# EAGLE design uStar (EAGLE 8.5.0)

## Sheet 1 of 3: Connections
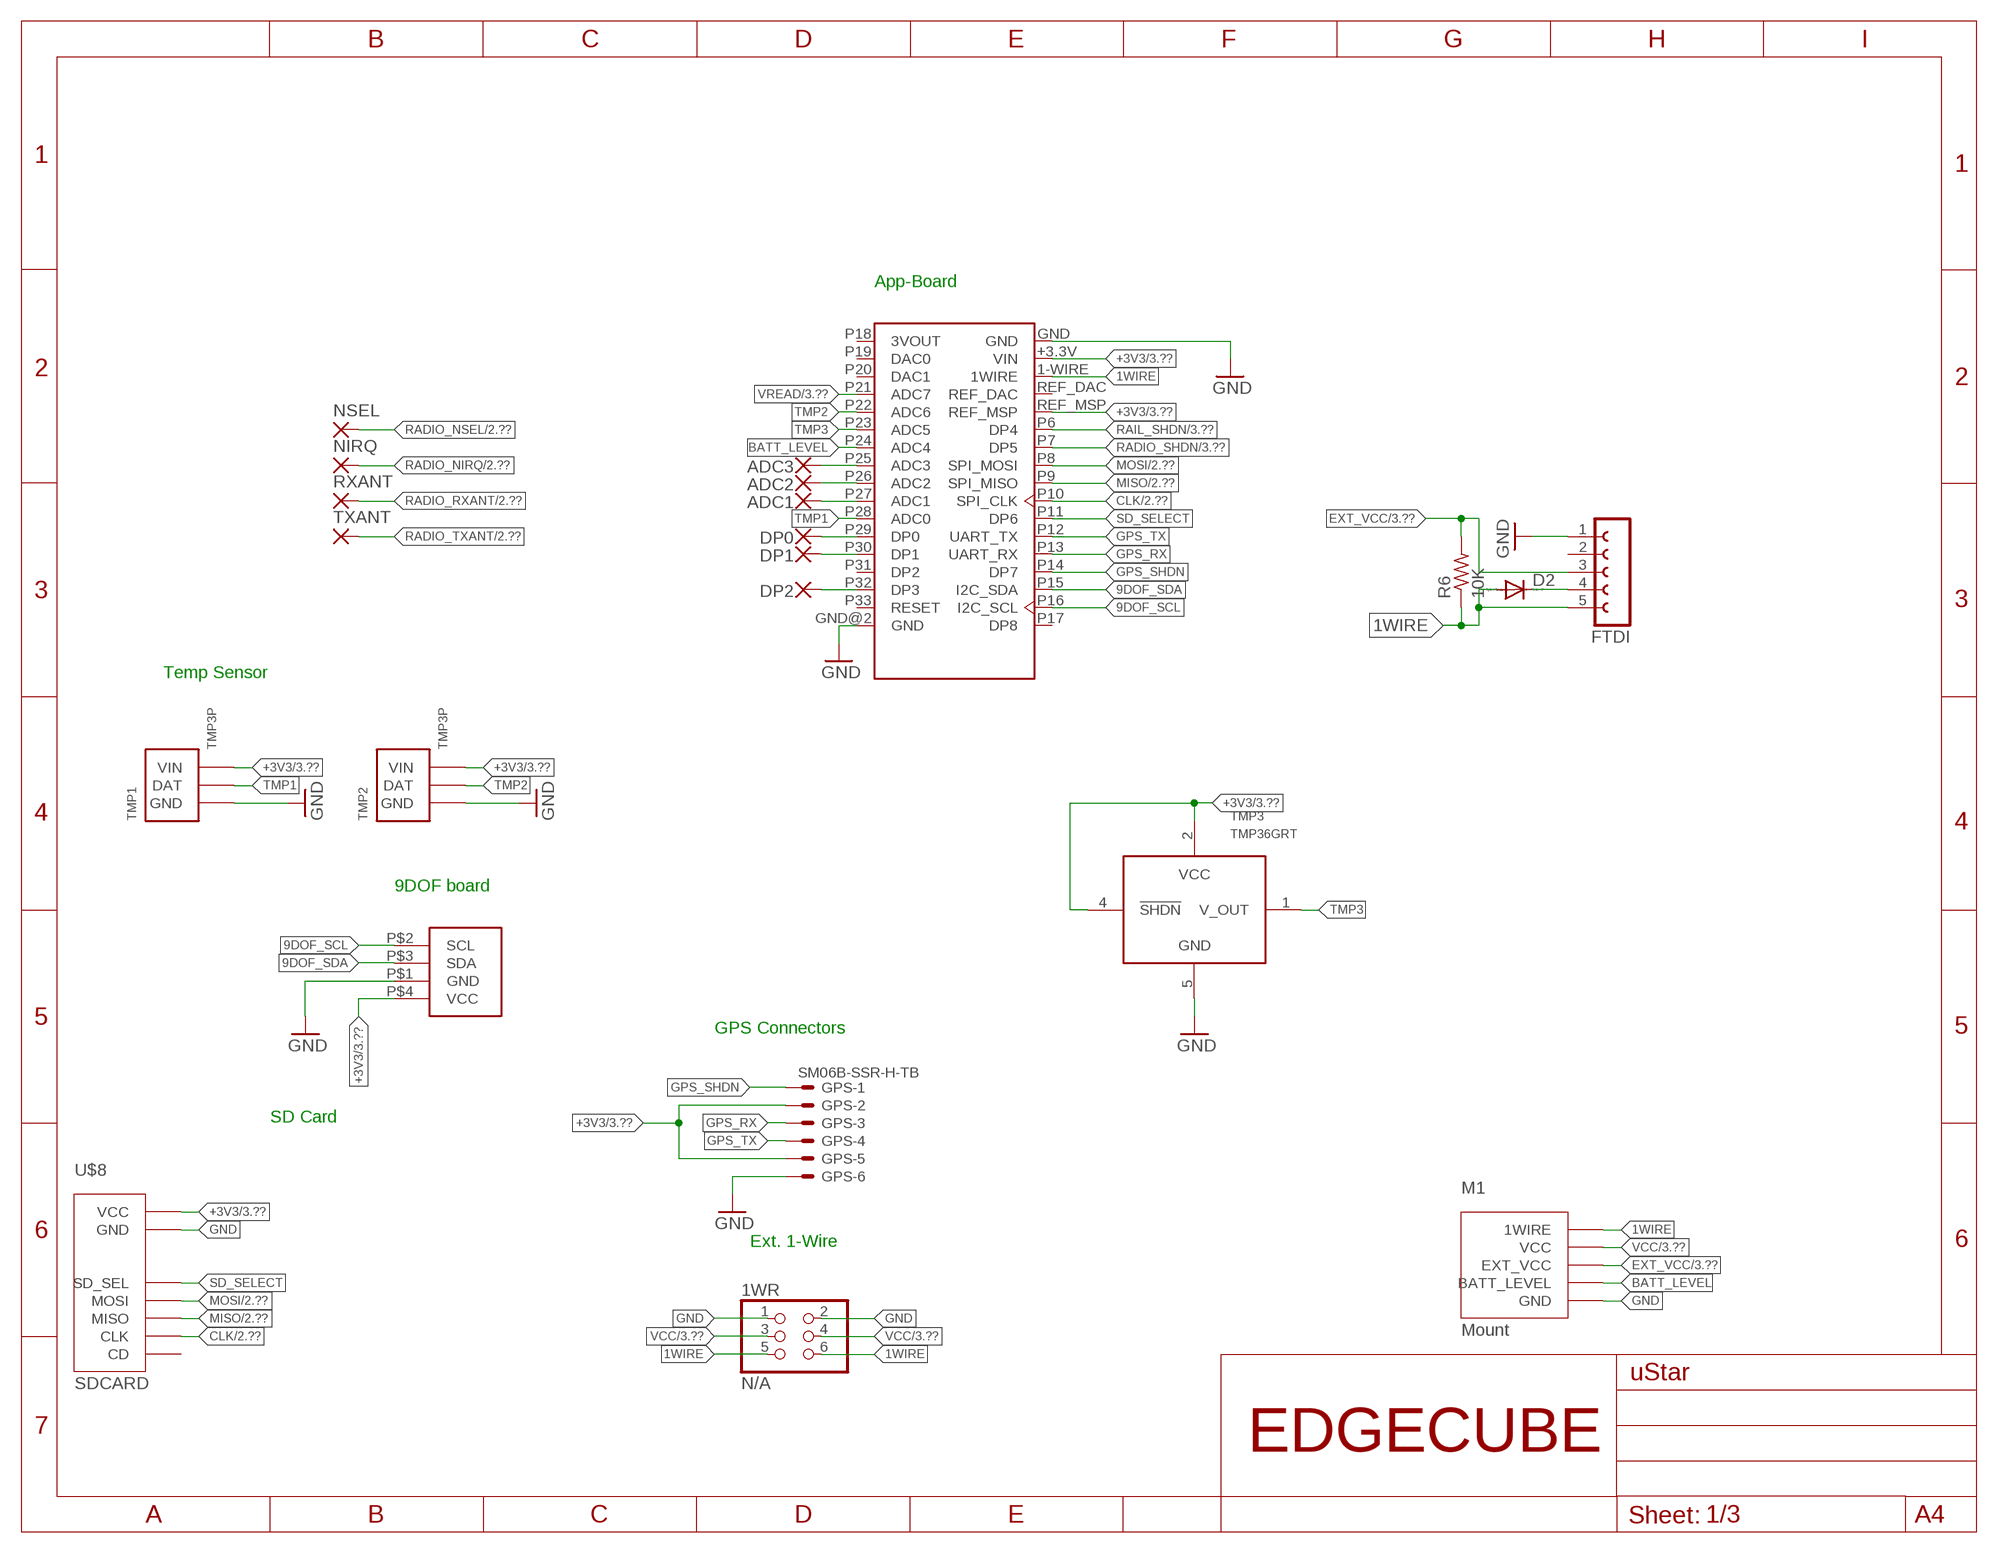
[diagram p0: schematic, sheet 1]
FRAME2 (SSEL_SHEET_A3): AUTHOR: Kevin Zack; SHEET_NAME: Connections

### Parts
1WR  N/A  PINHD-2X3  [2X03]
ADC1  1,6/0,9  [1,6/0,9]
ADC2  1,6/0,9  [1,6/0,9]
ADC3  1,6/0,9  [1,6/0,9]
D2  D-B260A  [SMA-DO214AC]
DP0  1,6/0,9  [1,6/0,9]
DP1  1,6/0,9  [1,6/0,9]
DP2  1,6/0,9  [1,6/0,9]
FTDI  FE05-1  [FE05-1]
GPS  SM06B-SSR-H-TB  [SM06B-SSR-H-TB]
M1  Mount  4X8MOUNT  [4X8MOUNT]
NIRQ  1,6/0,9  [1,6/0,9]
NSEL  1,6/0,9  [1,6/0,9]
R6  10K  RES-0603-10K  [R0603]
RXANT  1,6/0,9  [1,6/0,9]
TMP1  TMP3P  [TMP3P]
TMP2  TMP3P  [TMP3P]
TMP3  TMP36GRT  [SOT-23-5]
TXANT  1,6/0,9  [1,6/0,9]
U$1  App-Board 1.2/1.3  APP_CORE  [APPCORE_RECEIVER]
U$5  9DOF  [9DOF]
U$8  SDCARD  [SDCARD]

### Nets
1WIRE: 1WR.5 1WR.6 D2.A FTDI.5 M1.P$2(1WIRE) M1.P$5(1WIRE) R6.1 U$1.1-WIRE(1WIRE)
9DOF_SCL: U$1.P16(I2C_SCL) U$5.P$2(SCL)
9DOF_SDA: U$1.P15(I2C_SDA) U$5.P$3(SDA)
+3V3: GPS.2 GPS.5 TMP1.P$3(VIN) TMP2.P$3(VIN) TMP3.2(VCC) TMP3.4(!SHDN) U$1.+3.3V(VIN) U$1.REF_MSP U$5.P$4(VCC) U$8.P$3(VCC) ; also sheet 3
BATT_LEVEL: M1.P$6(BATT_LEVEL) U$1.P24(ADC4)
CLK: U$1.P10(SPI_CLK) U$8.P$4(CLK) ; also sheet 2
EXT_VCC: FTDI.3 M1.P$3(EXT_VCC) R6.2 ; also sheet 3
GND: 1WR.1 1WR.2 FTDI.1 GPS.6 M1.P$1(GND) M1.P$8(GND) TMP1.P$1(GND) TMP2.P$1(GND) TMP3.5(GND) U$1.GND U$1.GND@2(GND) U$5.P$1(GND) U$8.P$5(GND) ; also sheet 2,3
GPS_RX: GPS.3 U$1.P13(UART_RX)
GPS_SHDN: GPS.1 U$1.P14(DP7)
GPS_TX: GPS.4 U$1.P12(UART_TX)
MISO: U$1.P9(SPI_MISO) U$8.P$6(MISO) ; also sheet 2
MOSI: U$1.P8(SPI_MOSI) U$8.P$2(MOSI) ; also sheet 2
N$3: D2.K(C) FTDI.4
N$8: ADC1.1(P) U$1.P27(ADC1)
N$9: ADC2.1(P) U$1.P26(ADC2)
N$10: ADC3.1(P) U$1.P25(ADC3)
N$11: DP0.1(P) U$1.P29(DP0)
N$12: DP1.1(P) U$1.P30(DP1)
N$13: DP2.1(P) U$1.P32(DP3)
RADIO_NIRQ: NIRQ.1(P) ; also sheet 2
RADIO_NSEL: NSEL.1(P) ; also sheet 2
RADIO_RXANT: RXANT.1(P) ; also sheet 2
RADIO_SHDN: U$1.P7(DP5) ; also sheet 3
RADIO_TXANT: TXANT.1(P) ; also sheet 2
RAIL_SHDN: U$1.P6(DP4) ; also sheet 3
SD_SELECT: U$1.P11(DP6) U$8.P$1(SD_SEL)
TMP1: TMP1.P$2(DAT) U$1.P28(ADC0)
TMP2: TMP2.P$2(DAT) U$1.P22(ADC6)
TMP3: TMP3.1(V_OUT) U$1.P23(ADC5)
VCC: 1WR.3 1WR.4 M1.P$4(VCC) M1.P$7(VCC) ; also sheet 3
VREAD: U$1.P21(ADC7) ; also sheet 3
Unconnected: FTDI.2 U$1.P17(DP8) U$1.P18(3VOUT) U$1.P19(DAC0) U$1.P20(DAC1) U$1.P31(DP2) U$1.P33(RESET) U$1.REF_DAC U$8.P$7(CD)

### Notes on the sheet
- App-Board
- Temp Sensor
- 9DOF board
- GPS Connectors
- SD Card
- Ext. 1-Wire

## Sheet 2 of 3: Radio
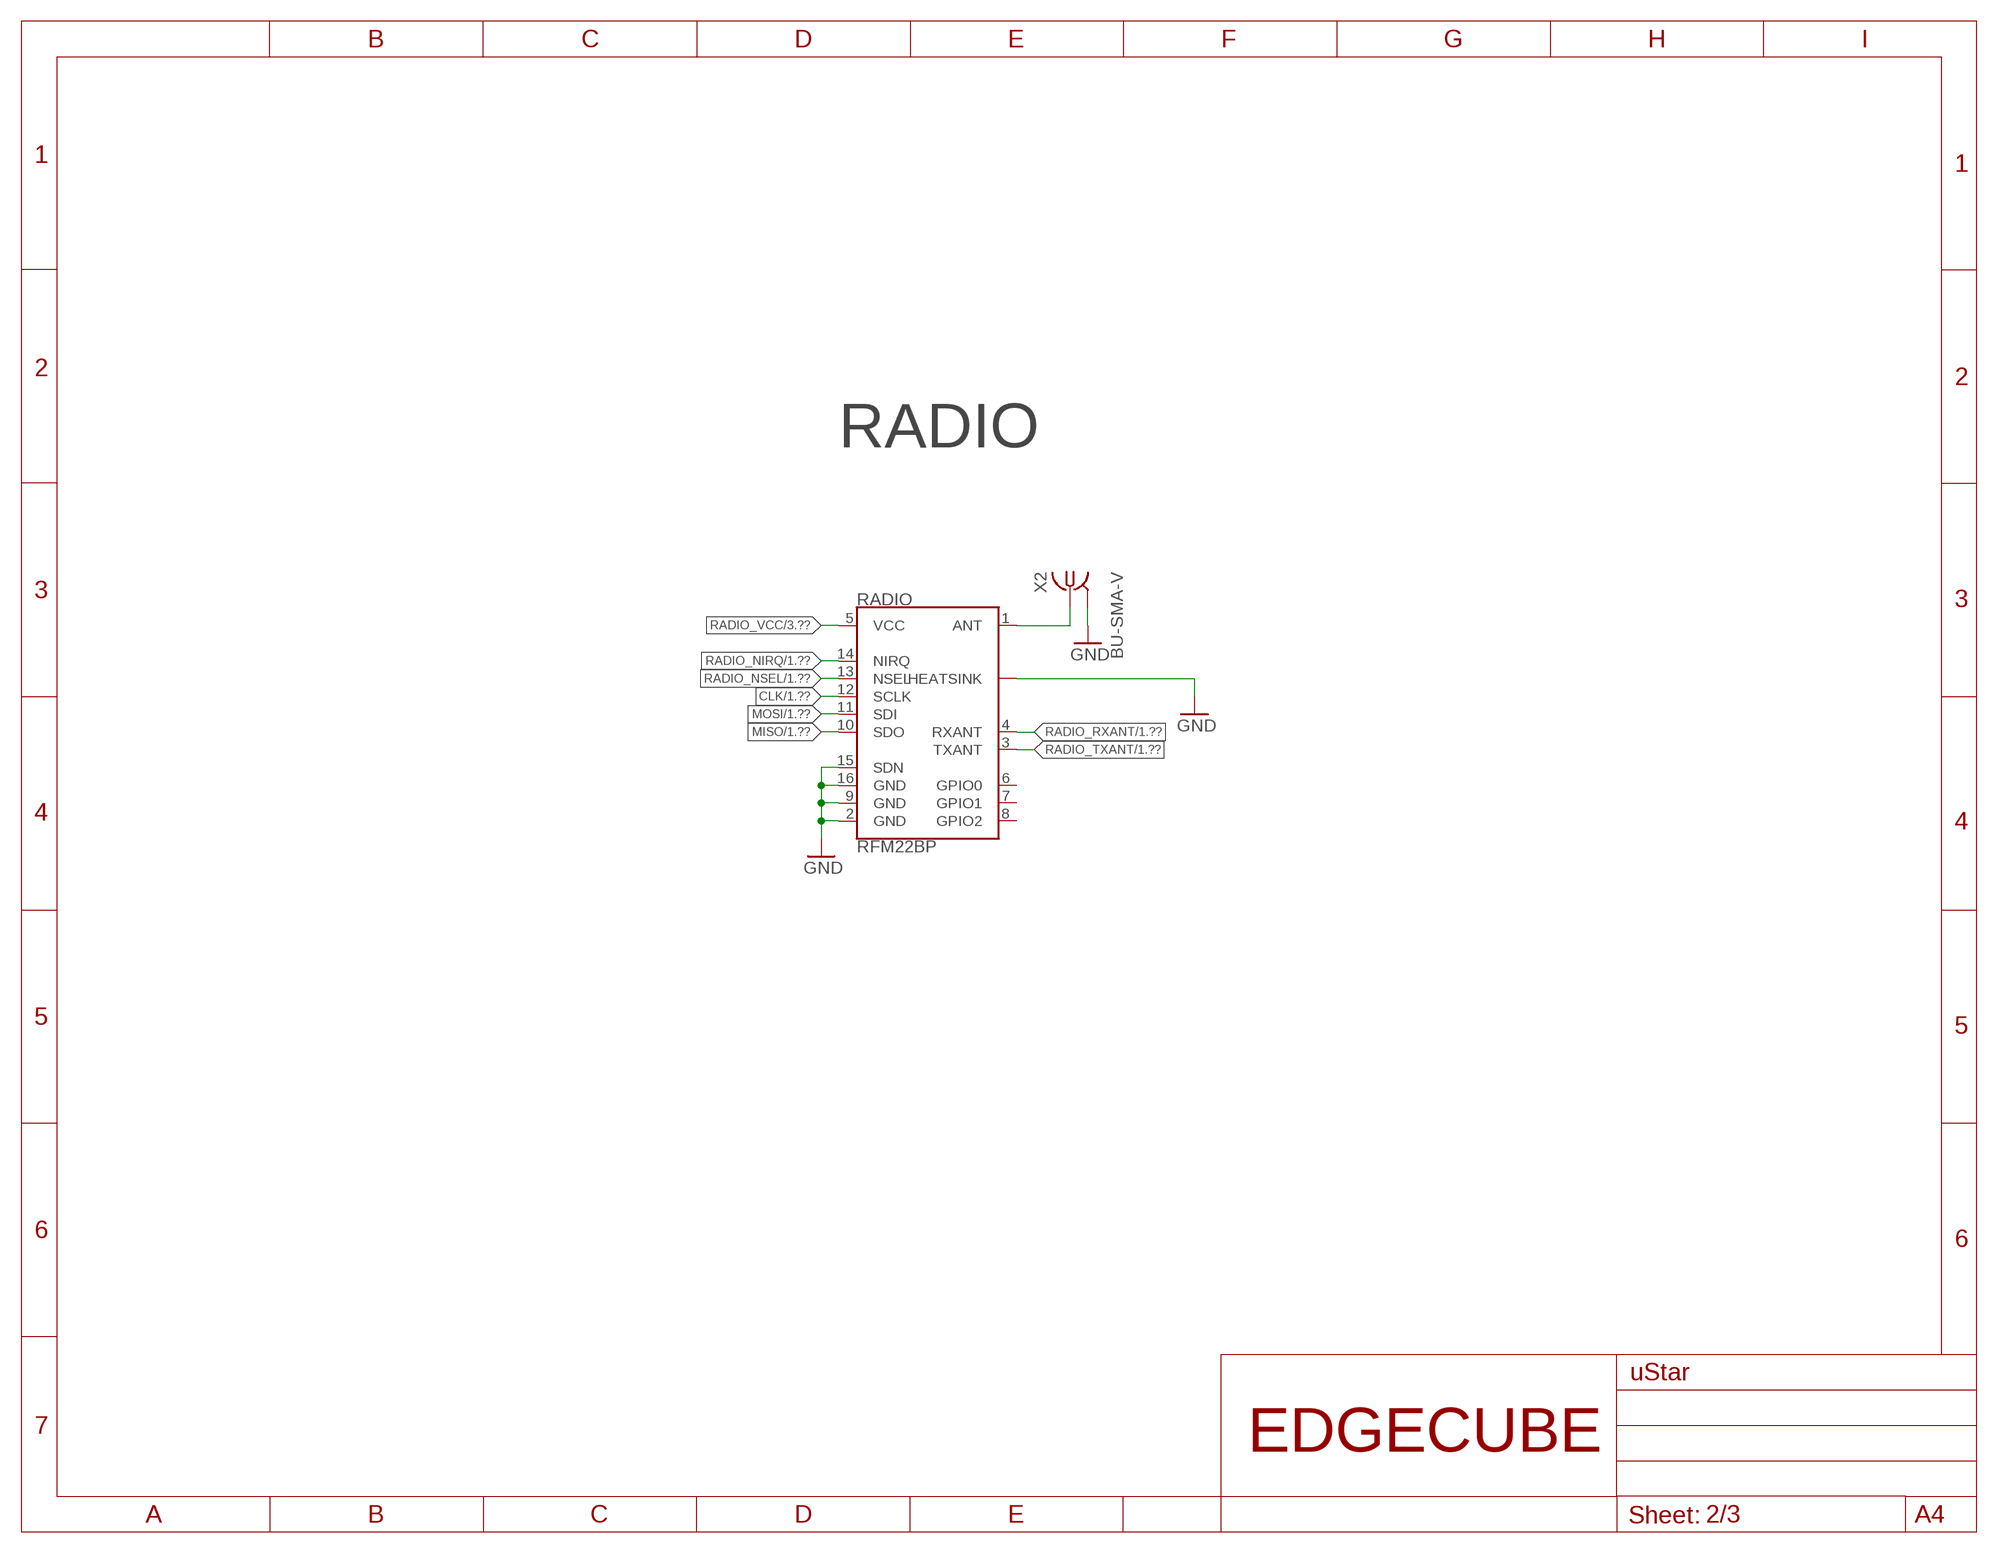
[diagram p1: schematic, sheet 2]
FRAME1 (SSEL_SHEET_A3): AUTHOR: Kevin Zack; SHEET_NAME: Radio

### Parts
RADIO  RFM22BP  [RFM22BP]
X2  BU-SMA-V  [BU-SMA-V]

### Nets
ANT: RADIO.1(ANT) X2.1
CLK: RADIO.12(SCLK) ; also sheet 1
GND: RADIO.2(GND) RADIO.9(GND) RADIO.15(SDN) RADIO.16(GND) RADIO.P$1(HEATSINK) X2.2 X2.3 X2.4 X2.5 ; also sheet 1,3
MISO: RADIO.10(SDO) ; also sheet 1
MOSI: RADIO.11(SDI) ; also sheet 1
RADIO_NIRQ: RADIO.14(NIRQ) ; also sheet 1
RADIO_NSEL: RADIO.13(NSEL) ; also sheet 1
RADIO_RXANT: RADIO.4(RXANT) ; also sheet 1
RADIO_TXANT: RADIO.3(TXANT) ; also sheet 1
RADIO_VCC: RADIO.5(VCC) ; also sheet 3
Unconnected: RADIO.6(GPIO0) RADIO.7(GPIO1) RADIO.8(GPIO2)

### Notes on the sheet
- RADIO

## Sheet 3 of 3: Power
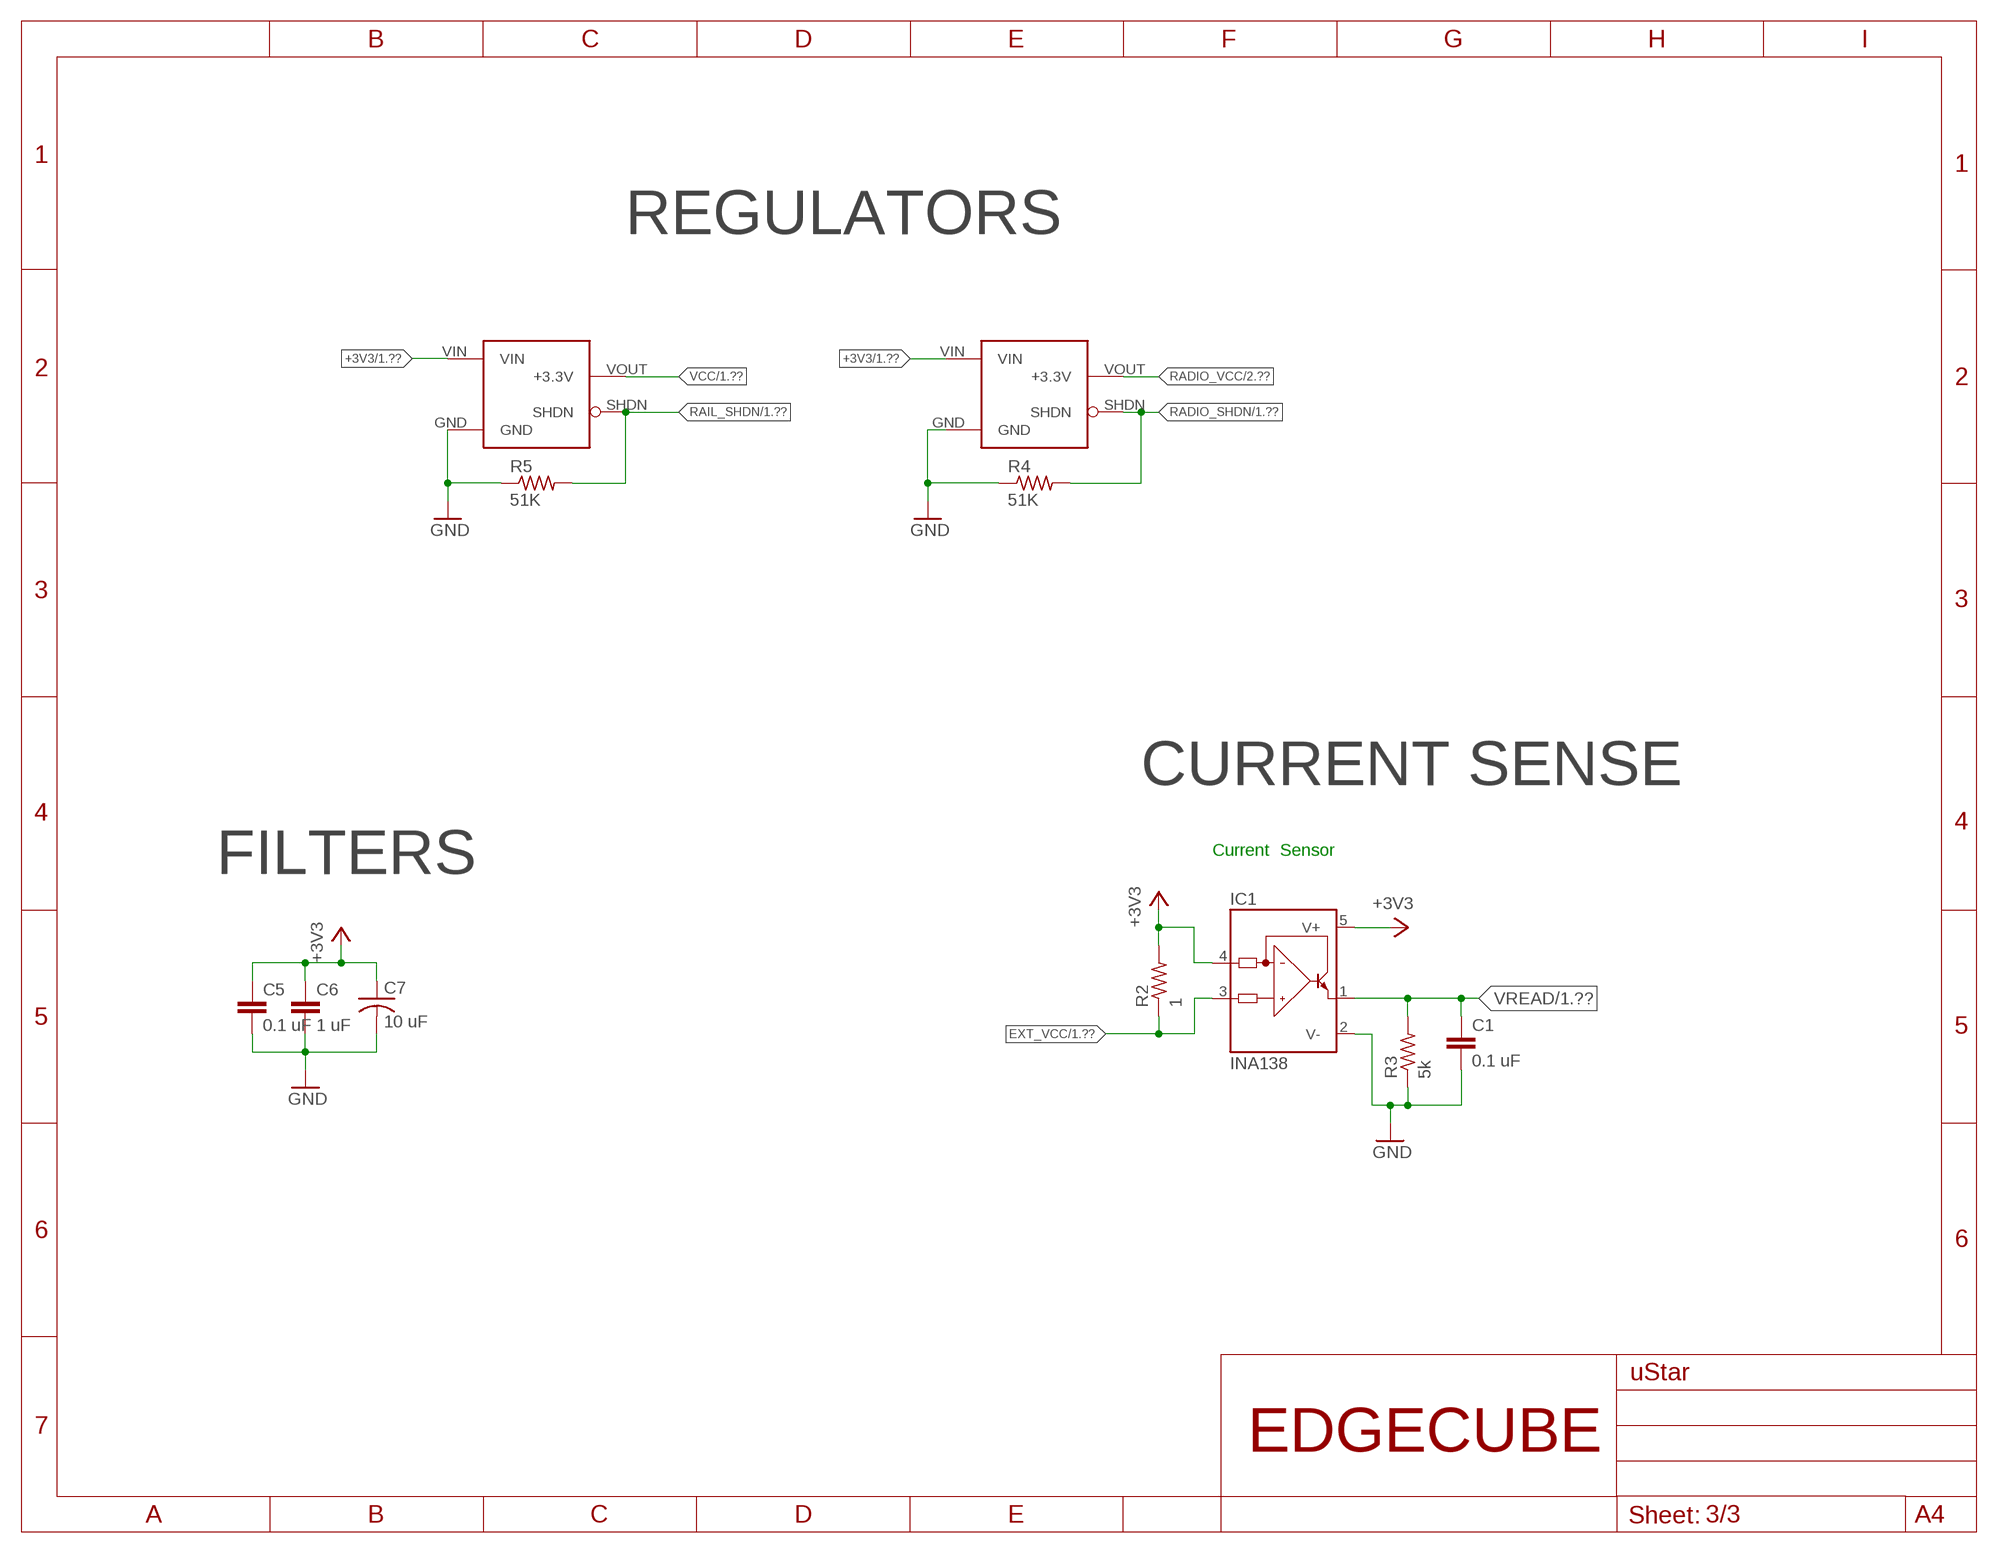
[diagram p2: schematic, sheet 3]
FRAME3 (SSEL_SHEET_A3): AUTHOR: Kevin Zack; SHEET_NAME: Power

### Parts
C1  0.1 uF  CAP-0603-0.1UF  [C0603]
C5  0.1 uF  CAP-0603-0.1UF  [C0603]
C6  1 uF  CAP-0603-1UF  [C0603]
C7  10 uF  CAP-0805-10UF-TANT  [C0805_POL]
IC1  INA138  [SOT23-5]
R2  1  R-US_R0603  [R0603]
R3  5k  R-US_R0603  [R0603]
R4  51K  RES-0603-51K  [R0603]
R5  51K  RES-0603-51K  [R0603]
U$3  S7V8F3_VOLT_REG-3V3_1AHORZ-DOWN  [S7V_DOWN]
U$7  S7V8F3_VOLT_REG-3V3_1AHORZ-DOWN  [S7V_DOWN]

### Nets
+3V3: C5.1 C6.1 C7.2 IC1.4(IN-) IC1.5(V+) R2.2 U$3.VIN U$7.VIN ; also sheet 1
EXT_VCC: IC1.3(IN+) R2.1 ; also sheet 1
GND: C1.2 C5.2 C6.2 C7.1 IC1.2(V-) R3.1 R4.1 R5.1 U$3.GND U$7.GND ; also sheet 1,2
RADIO_SHDN: R4.2 U$7.SHDN ; also sheet 1
RADIO_VCC: U$7.VOUT(+3.3V) ; also sheet 2
RAIL_SHDN: R5.2 U$3.SHDN ; also sheet 1
VCC: U$3.VOUT(+3.3V) ; also sheet 1
VREAD: C1.1 IC1.1(OUT) R3.2 ; also sheet 1

### Notes on the sheet
- REGULATORS
- CURRENT SENSE
- Current  Sensor
- FILTERS

## Library data of the parts
1WR = pinhead:PINHD-2X3: PIN HEADER
ADC1-ADC3 DP0 DP1 DP2 NIRQ NSEL RXANT TXANT = wirepad:1,6/0,9: THROUGH-HOLE PAD
C1 C5 = SSEL_RLC:CAP-0603-0.1UF: CAP CER 0.1UF 50V X7R 0603; DIGIKEY: 478-5052-1-ND; HEIGHT: 35 MIL; MANF-PN: 06035C104KAT2A; MANUFACTURER: AVX Corperation; PACKAGE: 0603; VOLTAGE: 50 V
C6 = SSEL_RLC:CAP-0603-1UF: CAP CER 0.1UF 50V X7R 0603; DIGIKEY: 587-2984-1-ND; HEIGHT: 35 MIL; MANF-PN: TMK107B7105KA-T; MANUFACTURER: Taiyo Yuden; PACKAGE: 0603; VALUE: 0.1 uF; VOLTAGE: 25 V
C7 = SSEL_RLC:CAP-0805-10UF-TANT: CAP TANT 10UF 10V X5R 0805; DIGIKEY: 478-3281-1-ND; MANF-PN: TAJP106M010RNJ; MANUFACTURE: AVX Corporation; PACKAGE: 0805; VOLTAGE: 10 V
D2 = SSEL_DIODE:D-B260A: DIODE SCHOTTKY 60V 2A SMA Datasheet <https://www.diodes.com/assets/Datasheets/ds13004.pdf>; CURRENT: 2A; DIGIKEY: B260A-FDICT-ND; HEIGHT: 91; MANF-PN: B260A-13-F; MANUFACTURER: Diodes Incorporated; PACKAGE: SMA; VOLTAGE: 60V
FTDI = con-lsta:FE05-1: FEMALE HEADER; OC_FARNELL: unknown; OC_NEWARK: unknown
GPS = con-jst2:SM06B-SSR-H-TB: Disconnectable Insulation displacement connector, 1.0mm pitch 6 contacts
IC1 = burr-brown:INA138: High-Side Measurement Current Shunt Monitor; MF: TEXAS INSTRUMENTS; MPN: INA138NA/250; OC_FARNELL: 1564888; OC_NEWARK: 80K5906
M1 = EDGEQUBE_MISC:4X8MOUNT: 4x8 MOUNT for EDGEQUBE
R2 R3 = resistor:R-US_: RESISTOR, American symbol
R4 R5 = SSEL_RLC:RES-0603-51K: RES SMD 51K OHM 1% 1/10W 0603; DIGIKEY: 541-51.0KHCT-ND; HEIGHT: 20 MIL; MANF-PN: CRCW060351K0FKEA; MANUFACTURER: Vishay Dale; PACKAGE: 0603; POWER: 0.1W
R6 = SSEL_RLC:RES-0603-10K: RES SMD 10K OHM 1% 1/10W 0603; DIGIKEY: 541-10.0KHCT-ND; HEIGHT: 20 MIL; MANF-PN: CRCW060310K0FKEA; MANUFACTURER: Vishay Dale; PACKAGE: 0603; POWER: 0.1W
RADIO = EDGEQUBE_PACKAGES:RFM22BP: RFM22BP 1W 433MHz Transceiver Datasheet <http://www.hoperf.com/upload/rf/RFM23BP.pdf>; FREQUENCY: 433 MHz; HEIGHT: 78 MIL; MANF-PN: RFM22BP; MANUFACTURER: HOPERF Electronic
TMP1 TMP2 = SSEL_MISC:TMP3P: TMP Sensor Wire Connection
TMP3 = SSEL_IC:TMP36GRT: SENSOR TEMP ANLG VOLT SOT-23-5 Datasheet <http://www.analog.com/media/en/technical-documentation/data-sheets/TMP35_36_37.pdf>; DIGIKEY: TMP36GRT-REEL7CT-ND; HEIGHT: 68.8 MIL; MANF-PN: TMP36GRT-REEL7; MANUFACTURER: Analog Devices Inc.; PACKAGE: SOT-23-5; VOLTAGE: 2.7V-5.5V
U$1 = LearningByMaking2:APP_CORE
U$3 U$7 = Pololu:S7V8F3_VOLT_REG-3V3_1A
U$5 = LearningByMaking:9DOF
U$8 = EDGEQUBE_PACKAGES:SDCARD: SD CARD Daugher Board
X2 = con-coax:BU-SMA-V: FEMALE SMA CONNECTOR Radiall distributor RS 112-3794; OC_FARNELL: unknown; OC_NEWARK: unknown

## Board
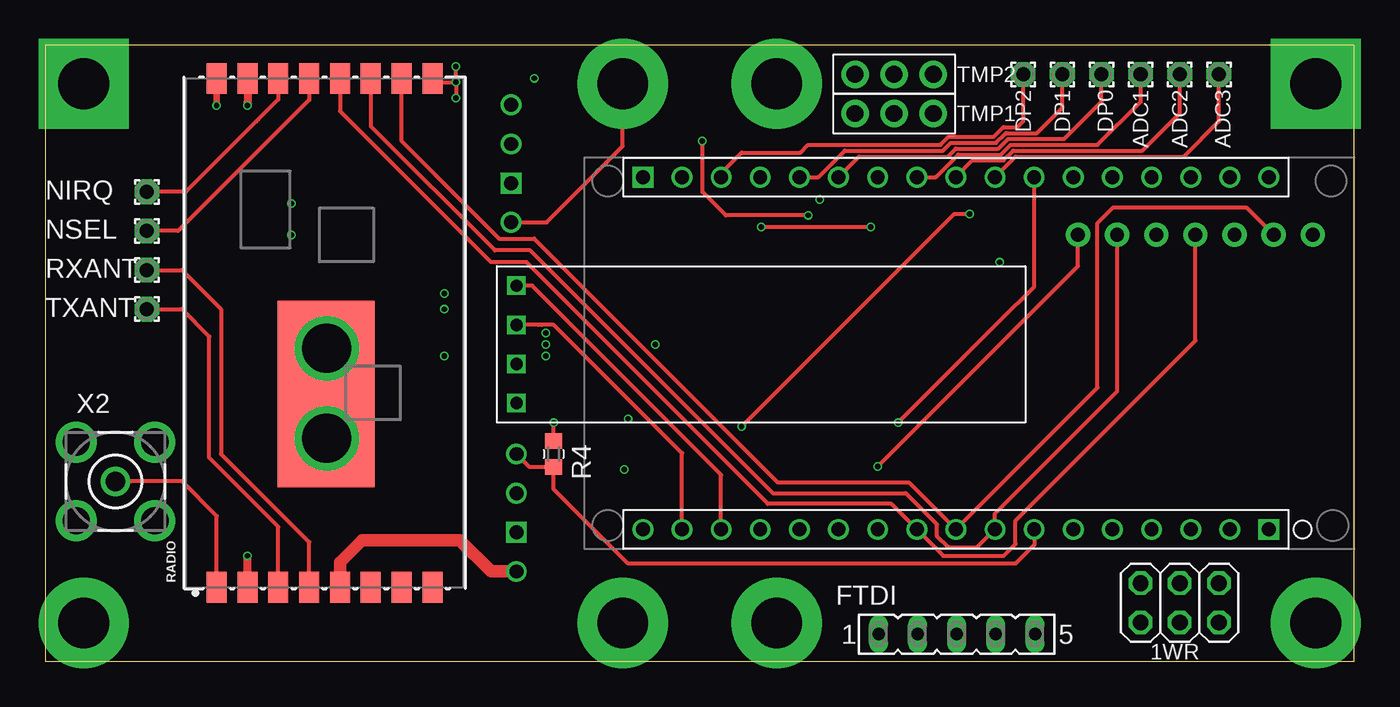
[diagram p3: board, top side]
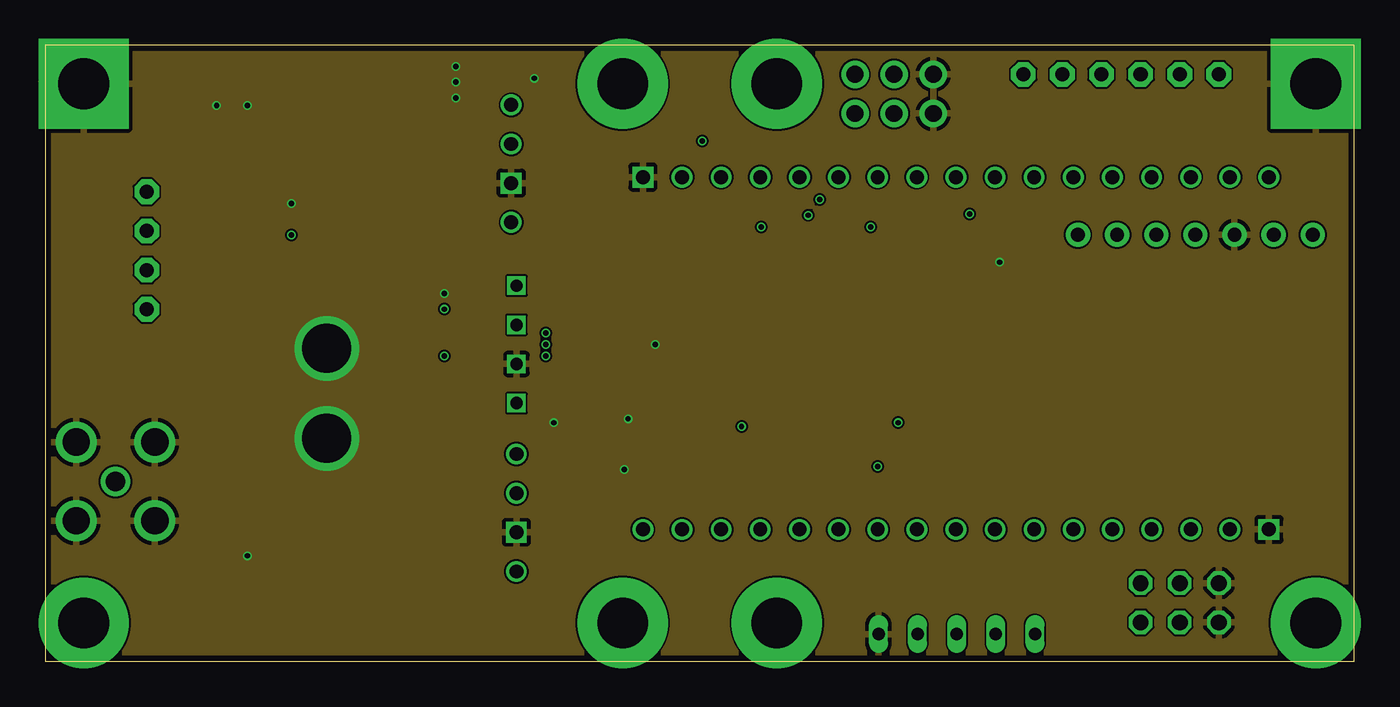
[diagram p4: board, inner layer GND]
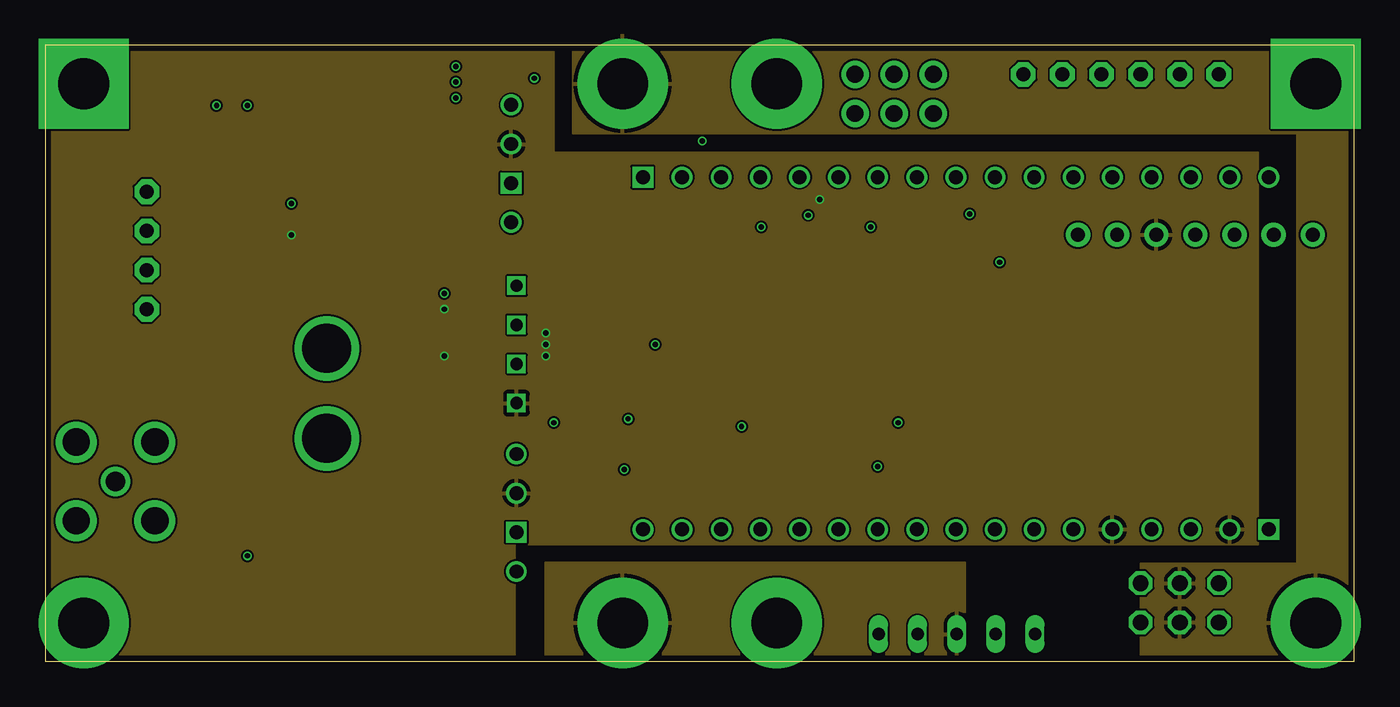
[diagram p5: board, inner layer Power]
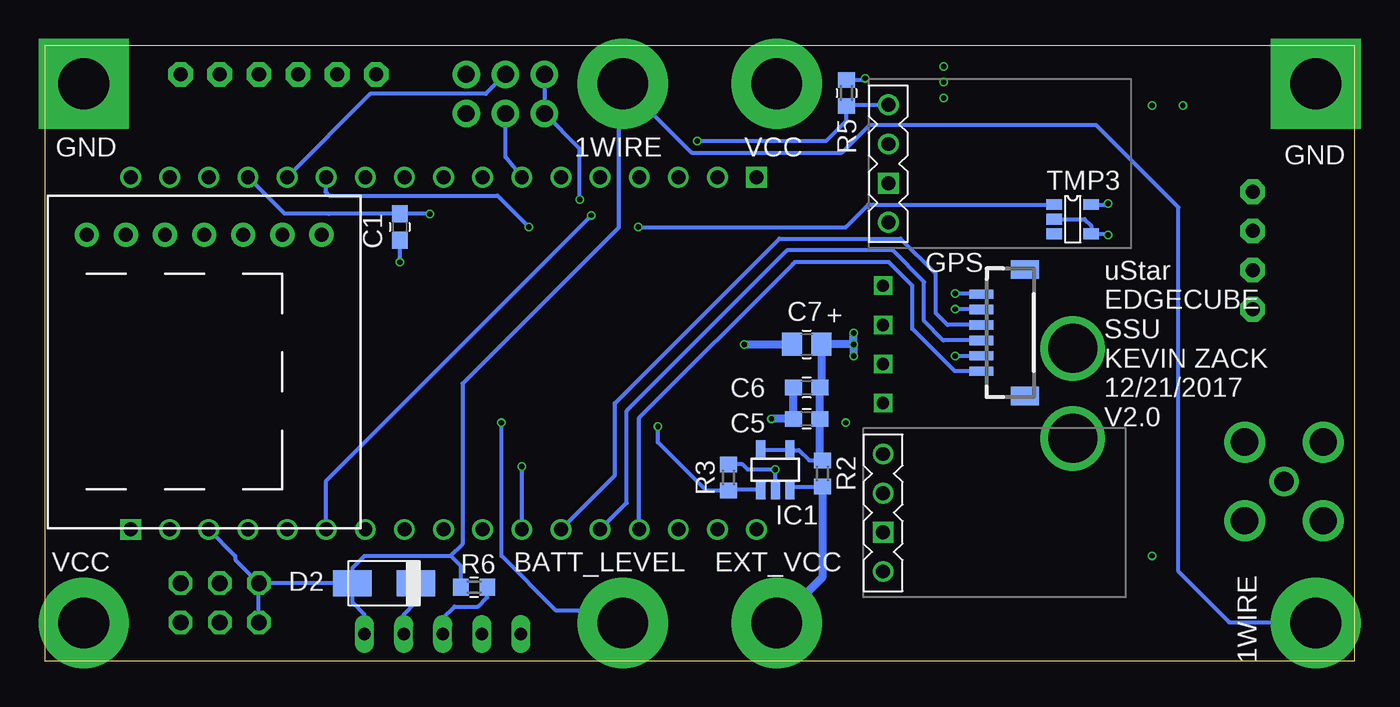
[diagram p6: board, bottom side, seen from below]

Size 85 x 40 mm. Coordinates in mm from the lower left corner, seen from the top.
Outline: 0,0 85,0 85,40 0,40 0,0
Copper layers (1*2*15*16): Top 0.035559375mm / dielectric 0.17018125mm / GND 0.01778125mm / dielectric 47mil / Power 0.01778125mm / dielectric 0.17018125mm / Bottom 0.035559375mm
Design rules "oshpark-4layer": minimum track width 5mil, minimum drill 10mil, track to track 5mil, track to pad 5mil, pad to pad 5mil, via to via 5mil, smd to smd 5mil, copper to edge 15mil, drill to drill 6mil, minimum pad ring 4mil, minimum via ring 4mil, stop-mask expansion 2.5mil, vias tented up to drill 0mil, thermal gap 10mil

### Footprints (pad centres in the part's own frame; a part is rotated, then mirrored left to right if it is on the bottom)
2X03 = drill 1.016 octagon: 1 -2.54,-1.27; 2 -2.54,1.27; 3 0,-1.27; 4 0,1.27; 5 2.54,-1.27; 6 2.54,1.27
1,6/0,9 = drill 0.914 pad 1.6 octagon: 1 0,0
C0603 = smd 1.1 x 1: 1 -0.85,0; 2 0.85,0
C0805_POL = smd 1.3 x 1.5: 1 -0.95,0; 2 0.95,0
SMA-DO214AC = smd 2.5 x 1.7: A -2.05,0; K 2.05,0
FE05-1 = drill 0.813 long: 1 -5.08,0; 2 -2.54,0; 3 0,0; 4 2.54,0; 5 5.08,0
SM06B-SSR-H-TB = smd 0.6 x 1.55: 1 -2.5,1.925; 2 -1.5,1.925; 3 -0.5,1.925; 4 0.5,1.925; 5 1.5,1.925; 6 2.5,1.925 | smd 1.2 x 1.8: FIT@1 -4.1,-0.9; FIT@2 4.1,-0.9
SOT23-5 = smd 0.6 x 1.2: 1 -0.95,-1.306; 2 0,-1.306; 3 0.95,-1.306; 4 0.95,1.306; 5 -0.95,1.306
4X8MOUNT = drill 3.3 pad 5.85 square: P$1 2.5,37.5; P$8 82.5,37.5 | drill 3.3 pad 5.85: P$2 2.502,2.5; P$3 37.5,2.5; P$4 37.5,37.5; P$5 47.5,37.5; P$6 47.5,2.5; P$7 82.5,2.5
R0603 = smd 1 x 1.1: 1 -0.85,0; 2 0.85,0
RFM22BP = smd 2 x 1.3: 1 0,14; 2 0,12; 3 0,10; 4 0,8; 5 0,6; 6 0,4; 7 0,2; 8 0,0; 9 33,0; 10 33,2; 11 33,4; 12 33,6; 13 33,8; 14 33,10; 15 33,12; 16 33,14 | smd 12.1 x 6.3: P$1 12.52,6.9
TMP3P = drill 1.1 pad 1.778: P$1 0,0; P$2 2.54,0; P$3 5.08,0
SOT-23-5 = smd 0.7 x 1: 1 -0.95,-1.2; 2 0,-1.2; 3 0.95,-1.2; 4 0.95,1.2; 5 -0.95,1.2
APPCORE_RECEIVER = drill 0.9: 1-WIRE 11.43,14.37; +3.3V 11.43,16.91; P6 11.43,6.75; P7 11.43,4.21; P8 11.43,1.67; P9 11.43,-0.87; P10 11.43,-3.41; P11 11.43,-5.95; P12 11.43,-8.49; P13 11.43,-11.03; P14 11.43,-13.57; P15 11.43,-16.11; P16 11.43,-18.65; P17 11.43,-21.19; P18 -11.43,19.45; P19 -11.43,16.91; P20 -11.43,14.37; P21 -11.43,11.83; P22 -11.43,9.29; P23 -11.43,6.75; P24 -11.43,4.21; P25 -11.43,1.67; P26 -11.43,-0.87; P27 -11.43,-3.41; P28 -11.43,-5.95; P29 -11.43,-8.49; P30 -11.43,-11.03; P31 -11.43,-13.57; P32 -11.43,-16.11; P33 -11.43,-18.65; REF_DAC 11.43,11.83; REF_MSP 11.43,9.29 | drill 0.9 square: GND 11.43,19.45; GND@2 -11.43,-21.19
S7V_DOWN = drill 0.9 square: GND 1.27,-7.23 | drill 0.9: SHDN -3.81,-7.23; VIN -1.27,-7.23; VOUT 3.81,-7.23
9DOF = drill 0.8 square: P$1 0,-1.27; P$2 0,1.27; P$3 0,3.81; P$4 0,-3.81
SDCARD = drill 0.9 pad 1.575: P$1 0,0; P$2 2.54,0; P$3 5.08,0; P$4 7.62,0; P$5 10.16,0; P$6 12.7,0; P$7 15.24,0
BU-SMA-V = drill 1.27: 1 0,0 | drill 1.778: 2 -2.55,2.55; 3 2.55,2.55; 4 2.55,-2.55; 5 -2.55,-2.55

### Placement (x,y rotation side)
1WR  73.66,3.81 180 top
ADC1  71.12,38.1 0 top
ADC2  73.66,38.1 0 top
ADC3  76.2,38.1 0 top
C1  61.98,28.19 270 bottom
C5  35.56,15.75 180 bottom
C6  35.56,17.78 180 bottom
C7  35.56,20.57 0 bottom
D2  62.99,5.08 0 bottom
DP0  68.58,38.1 0 top
DP1  66.04,38.1 0 top
DP2  63.5,38.1 0 top
FTDI  59.18,1.78 0 top
GPS  22.3,21.33 90 bottom
IC1  37.59,12.45 0 bottom
M1  0,0 0 top
NIRQ  6.6,30.48 0 top
NSEL  6.6,27.94 0 top
R2  34.54,12.19 90 bottom
R3  40.64,11.94 270 bottom
R4  33.02,13.46 270 top
R5  32.97,36.88 270 bottom
R6  57.15,4.83 0 bottom
RADIO  25.15,4.83 90 top
RXANT  6.6,25.4 0 top
TMP1  57.66,35.56 180 top
TMP2  57.66,38.1 180 top
TMP3  18.29,28.7 270 bottom
TXANT  6.6,22.86 0 top
U$1  60,20 270 top
U$3  23.03,32.31 270 bottom
U$5  30.61,20.57 0 top
U$7  23.37,9.65 270 bottom
U$8  67.06,27.69 0 top
X2  4.57,11.68 0 top

### Tracks (layer width: path | path; a pad name or v marks a point on that pad's centre or on a via)
1WIRE
  Bottom 0.254: U$1.1-WIRE 72.64,6.84 72.64,6.6 1WR.5 | 1WR.6 1WR.5 | M1.P$2 2.72,2.29 3.05,2.29 3.3,2.54 8.13,2.54 11.43,5.84 11.43,29.46 16.76,34.8 31.5,34.8 33.27,33.02 43.02,33.02 M1.P$5 47.75,37.25 47.75,28.19 57.91,18.03 57.91,7.62 58.67,6.86 | FTDI.5 64.26,3.05 65.04,3.83 D2.A | D2.A 1WR.5 | D2.A 65.04,6.08 64.26,6.86 58.67,6.86 | R6.1 58,6.18 58.67,6.86
9DOF_SCL
  Top 0.254: U$5.P$2 32,21.84 32.26,21.84 33.02,21.84 34.42,20.45 41.35,13.51 U$1.P16
9DOF_SDA
  Top 0.254: U$1.P15 43.89,12.12 31.62,24.38 U$5.P$3
+3V3  (via drill 0.35, 0.35 pad 0.55)
  Bottom 0.254: IC1.5 IC1.4 36.61,13.72 36.07,13.72 35.39,13.04 R2.2 | GPS.2 24.24,19.81 v25.91,19.81 | GPS.5 24.25,22.86 v25.91,22.86 | TMP2.P$3 TMP1.P$3 50.29,33.27 v50.29,29.97 | v16,27.69 16.07,27.75 TMP3.4 17.09,28.26 17.53,28.7 TMP3.2
  Bottom 0.508: R2.2 34.71,13.21 C5.1 C6.1 | C6.1 34.54,17.78 34.57,17.5 | v32.51,20.57 C7.2 34.61,17.88 C6.1 | v32.51,20.57 v32.51,19.81 | v32.51,20.57 v32.51,21.31 32.51,21.34
  pour Power: 0,0 30.48,0 30.48,7.62 78.74,7.62 78.74,33.02 33.02,33.02 33.02,40.64 0,40.64
ANT
  Top 0.254: RADIO.1 11.15,9.43 8.89,11.68 X2.1
BATT_LEVEL  (via drill 0.35 pad 0.55)
  Top 0.254: v55.37,15.49 61.85,21.97 61.98,22.1 64.21,24.33 U$1.P24
  Bottom 0.254: M1.P$6 48.3,3.3 51.82,3.3 55.37,6.86 v55.37,15.49
CLK
  Top 0.254: RADIO.12 19.15,35.72 28.96,25.91 31.24,25.91 46.92,10.23 54.93,10.23 U$1.P10 58.3,6.86 62.23,6.86 62.99,7.62 62.99,9.14 74.68,20.83 U$8.P$4
EXT_VCC
  Bottom 0.254: IC1.3 36.44,11.34 R2.1 | FTDI.3 59.18,2.79 58.42,3.56 56.9,3.56 56.3,4.15 R6.2
  Bottom 0.508: M1.P$3 34.54,5.46 R2.1
  pour Power: 32.51,6.35 32.51,-0.25 59.69,0 59.69,6.35
GND  (via drill 0.35, 0.35 pad 0.55, 3.17 pad 0.55)
  Top 0.152: RADIO.P$1 18.29,17.27
  Top 0.254: 25.17,37.85 RADIO.9 25.38,37.59 v26.67,37.59 | v26.67,37.59 v26.67,38.61 | v26.67,37.59 v26.67,36.58 | R4.1 v33.02,15.49 | v18.29,20.32 18.29,17.27 v18.29,14.48
  Top 0.406: RADIO.16 11.15,36.1 v11.14,36.07
  Top 0.508: RADIO.2 13.15,6.8 v13.14,6.86 | RADIO.15 13.15,36.26 v13.15,36.07
  Bottom 0.254: IC1.2 v37.59,12.45 39.37,12.45 39.71,12.79 R3.1 | C1.2 v61.98,25.91 | GPS.6 24.26,23.88 v25.91,23.88 | TMP3.5 16.07,29.65 v16,29.72 | R5.1 31.86,37.73 v31.75,37.85
  Bottom 0.508: 36.66,20.69 C7.1 v39.62,20.57 | C6.2 C5.2 v37.85,15.75
  pour Bottom (isolate 0.406): 85.09,40.13 85.09,38.35 85.09,0
  pour GND: -0.25,40.13 85.09,40.13 85.09,0 0,0
GPS_RX
  Bottom 0.254: U$1.P13 47.24,10.3 47.24,16.26 36.83,26.67 29.97,26.67 27.94,24.64 27.94,22.1 26.67,20.83 26.66,20.83 GPS.3
GPS_SHDN
  Bottom 0.254: U$1.P14 46.43,15.8 36.45,25.78 36.32,25.91 30.23,25.91 28.7,24.38 28.7,21.59 25.95,18.83 GPS.1 24.26,18.8
GPS_TX
  Bottom 0.254: U$1.P12 48.01,12.07 48.01,16.76 37.34,27.43 29.46,27.43 27.18,25.15 27.18,22.61 26.42,21.84 24.23,21.84 GPS.4
MISO
  Top 0.254: RADIO.10 23.15,33.75 29.46,27.43 31.75,27.43 47.56,11.62 56.08,11.62 59.12,8.58 59.13,8.58 U$1.P9 68.33,17.77 68.33,28.45 69.34,29.46 77.98,29.46 U$8.P$6
MOSI
  Top 0.254: RADIO.11 21.15,34.73 29.21,26.67 31.5,26.67 47.24,10.92 55.88,10.92 57.91,8.89 57.91,8.13 58.67,7.37 60.47,7.37 U$1.P8 61.67,9.6 69.6,17.53 U$8.P$2
N$3
  Bottom 0.254: FTDI.4 61.72,3.05 60.94,3.83 D2.K
N$8
  Top 0.254: ADC1.1 71.12,36.32 68.33,33.53 62.69,33.53 62.05,32.89 59.28,32.89 57.82,31.43 U$1.P27
N$9
  Top 0.254: ADC2.1 73.66,35.56 71.25,33.15 62.85,33.15 62.21,32.51 60.21,32.51 U$1.P26
N$10
  Top 0.254: U$1.P25 63.01,32.77 73.91,32.77 76.2,35.05 ADC3.1
N$11
  Top 0.254: DP0.1 68.58,36.32 66.17,33.91 62.53,33.91 61.9,33.27 59.12,33.27 58.61,32.77 52.85,32.77 U$1.P29
N$12
  Top 0.254: U$1.P30 50.2,31.43 51.91,33.15 58.29,33.15 58.8,33.66 61.72,33.66 61.74,33.66 62.38,34.29 64.39,34.29 66.04,35.94 DP1.1
N$13
  Top 0.254: U$1.P32 43.89,31.7 45.21,33.02 49.02,33.02 49.53,33.53 58.13,33.53 58.64,34.04 61.58,34.04 62.22,34.67 63.12,34.67 63.5,35.05 DP2.1
RADIO_NIRQ
  Top 0.254: RADIO.14 15.15,36.48 13.84,35.18 13.72,35.05 9.14,30.48 NIRQ.1
RADIO_NSEL
  Top 0.254: RADIO.13 17.15,36.45 8.64,27.94 NSEL.1
  Top 0.508: RADIO.13 17.02,37.7
RADIO_RXANT
  Top 0.254: RADIO.4 17.15,7.75 11.43,13.46 11.43,22.86 8.89,25.4 RXANT.1
RADIO_SHDN
  Top 0.254: U$1.P7 64.21,7.57 62.99,6.35 37.85,6.35 33.02,11.18 R4.2 31.45,12.61 U$7.SHDN
RADIO_TXANT
  Top 0.254: RADIO.3 15.15,8.73 10.67,13.21 10.67,21.08 8.89,22.86 TXANT.1
RADIO_VCC
  Top 0.813: U$7.VOUT 28.96,5.84 26.92,7.87 20.57,7.87 19.15,6.45 RADIO.5
RAIL_SHDN  (via drill 0.35 pad 0.55)
  Top 0.254: v49.53,28.96 44.2,28.96 42.67,30.48 v42.67,33.78
  Bottom 0.254: U$1.P6 66.75,11.74 v49.53,28.96 | v42.67,33.78 34.29,33.78 32.97,35.1 R5.2 32.89,36.12 U$3.SHDN
SD_SELECT  (via drill 0.35 pad 0.55)
  Top 0.254: v54.05,12.65 67.06,25.65 U$8.P$1
  Bottom 0.254: U$1.P11 v54.05,12.65
TMP1
  Bottom 0.254: U$1.P28 55.12,32.75 TMP1.P$2
TMP2
  Bottom 0.254: TMP2.P$2 56.39,36.83 63.89,36.83 U$1.P22
TMP3  (via drill 0.35)
  Top 0.254: v53.59,28.19 v46.48,28.19
  Bottom 0.254: U$1.P23 66.8,31.38 66.8,30.48 66.55,30.23 55.63,30.23 v53.59,28.19 | v46.48,28.19 33.02,28.19 31.56,29.65 31.43,29.65 31.24,29.65 TMP3.1
VCC
  Top 0.254: U$3.VOUT 32.56,28.5 37.5,33.44 M1.P$4
  pour Power: 85.09,40.64 85.09,0 71.12,0 71.12,6.35 81.28,6.35 81.28,34.29 34.29,34.29 34.29,40.64
VREAD  (via drill 0.35 pad 0.55)
  Top 0.254: v45.21,15.24 59.02,29.04 v60.03,29.04
  Bottom 0.254: IC1.1 40.59,11.14 R3.2 42.08,11.09 45.21,14.22 v45.21,15.24 | v60.03,29.04 C1.1 66.58,29.04 66.59,29.06 69.46,29.06 U$1.P21

### Text on the board
bNames: VCC | 1WIRE | GND | GND | uStar / EDGECUBE / SSU / KEVIN ZACK / 12/21/2017 / V2.0 | EXT_VCC | BATT_LEVEL | VCC | 1WIRE